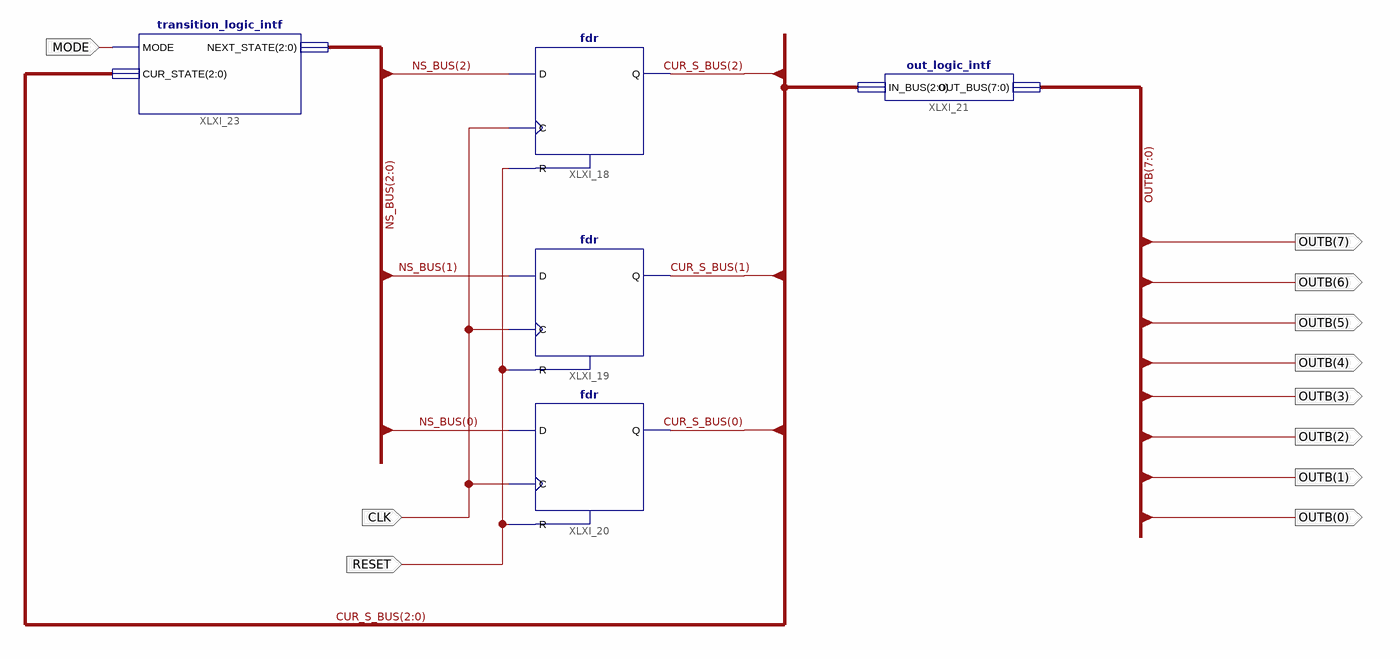
[diagram p0: schematic sheet 1]
// Xilinx ISE schematic LightController.sch (spartan3a) as structural Verilog: 5 symbols, 11 ports
module LightController (
  input  CLK,
  input  MODE,
  input  RESET,
  output [7:0] OUTB
);

  wire [2:0] CUR_S_BUS, NS_BUS;

  fdr XLXI_18 (.C(CLK), .D(NS_BUS[2]), .R(RESET), .Q(CUR_S_BUS[2]));
  fdr XLXI_19 (.C(CLK), .D(NS_BUS[1]), .R(RESET), .Q(CUR_S_BUS[1]));
  fdr XLXI_20 (.C(CLK), .D(NS_BUS[0]), .R(RESET), .Q(CUR_S_BUS[0]));
  out_logic_intf XLXI_21 (.IN_BUS(CUR_S_BUS), .OUT_BUS(OUTB));
  transition_logic_intf XLXI_23 (.MODE(MODE), .CUR_STATE(CUR_S_BUS), .NEXT_STATE(NS_BUS));
endmodule
